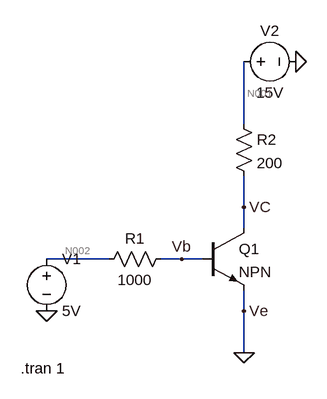
[diagram p0: schematic Circuito1.asc]
Circuito1.asc, the LTspice schematic file:
Version 4.1
SHEET 1 880 680
WIRE 368 -144 368 -240
WIRE 368 -16 368 -64
WIRE 368 16 368 -16
WIRE 160 64 64 64
WIRE 272 64 240 64
WIRE 304 64 272 64
WIRE 368 144 368 112
WIRE 368 208 368 144
FLAG 448 -240 0
FLAG 64 144 0
FLAG 368 208 0
FLAG 272 64 Vb
FLAG 368 -16 VC
FLAG 368 144 Ve
SYMBOL voltage 64 48 R0
WINDOW 123 0 0 Left 0
WINDOW 39 0 0 Left 0
SYMATTR InstName V1
SYMATTR Value 5V
SYMBOL res 256 48 R90
WINDOW 0 0 56 VBottom 2
WINDOW 3 32 56 VTop 2
SYMATTR InstName R1
SYMATTR Value 1000
SYMBOL npn 304 16 R0
SYMATTR InstName Q1
SYMBOL res 352 -160 R0
SYMATTR InstName R2
SYMATTR Value 200
SYMBOL voltage 352 -240 R270
WINDOW 0 32 56 VTop 2
WINDOW 3 -32 56 VBottom 2
WINDOW 123 0 0 Left 0
WINDOW 39 0 0 Left 0
SYMATTR InstName V2
SYMATTR Value 15V
TEXT 24 232 Left 2 !.tran 1

The netlist it stands for:
* Circuito1.asc
V1 N002 0 5V
R1 Vb N002 1000
Q1 VC Vb 0 0 NPN
R2 N001 VC 200
V2 N001 0 15V
.model NPN NPN
.model PNP PNP
.lib standard.bjt
.tran 1
.backanno
.end

* Results of the author's LTspice run, read from the files saved beside the schematic
* Operating Point, zero values left out:
*   V(vb) = 888 mV
*   V(n001) = 15 V
*   V(n002) = 5 V
*   V(vc) = 82.84 mV
*   I(V1) = -4.112 mA
*   Ic(Q1) = 74.59 mA
*   Ib(Q1) = 4.112 mA
*   Ie(Q1) = -78.7 mA
*   I(V2) = -74.59 mA
*   I(R2) = 74.59 mA
*   I(R1) = -4.112 mA
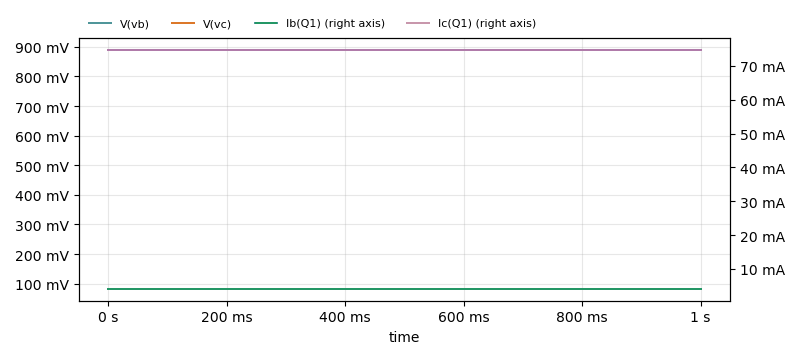
[diagram p1: Transient Analysis of Circuito1.asc, plotted from the saved traces]
* Transient Analysis, 1 run:
*   V(vb): min 888 mV, max 888 mV, average 888 mV, rms 888 mV, last 888 mV
*   V(vc): min 82.84 mV, max 82.84 mV, average 82.84 mV, rms 82.84 mV, last 82.84 mV
*   Ib(Q1): min 4.112 mA, max 4.112 mA, average 4.112 mA, rms 4.112 mA, last 4.112 mA
*   Ic(Q1): min 74.59 mA, max 74.59 mA, average 74.59 mA, rms 74.59 mA, last 74.59 mA